# EAGLE schematic AutoCar (EAGLE 9.5.0)
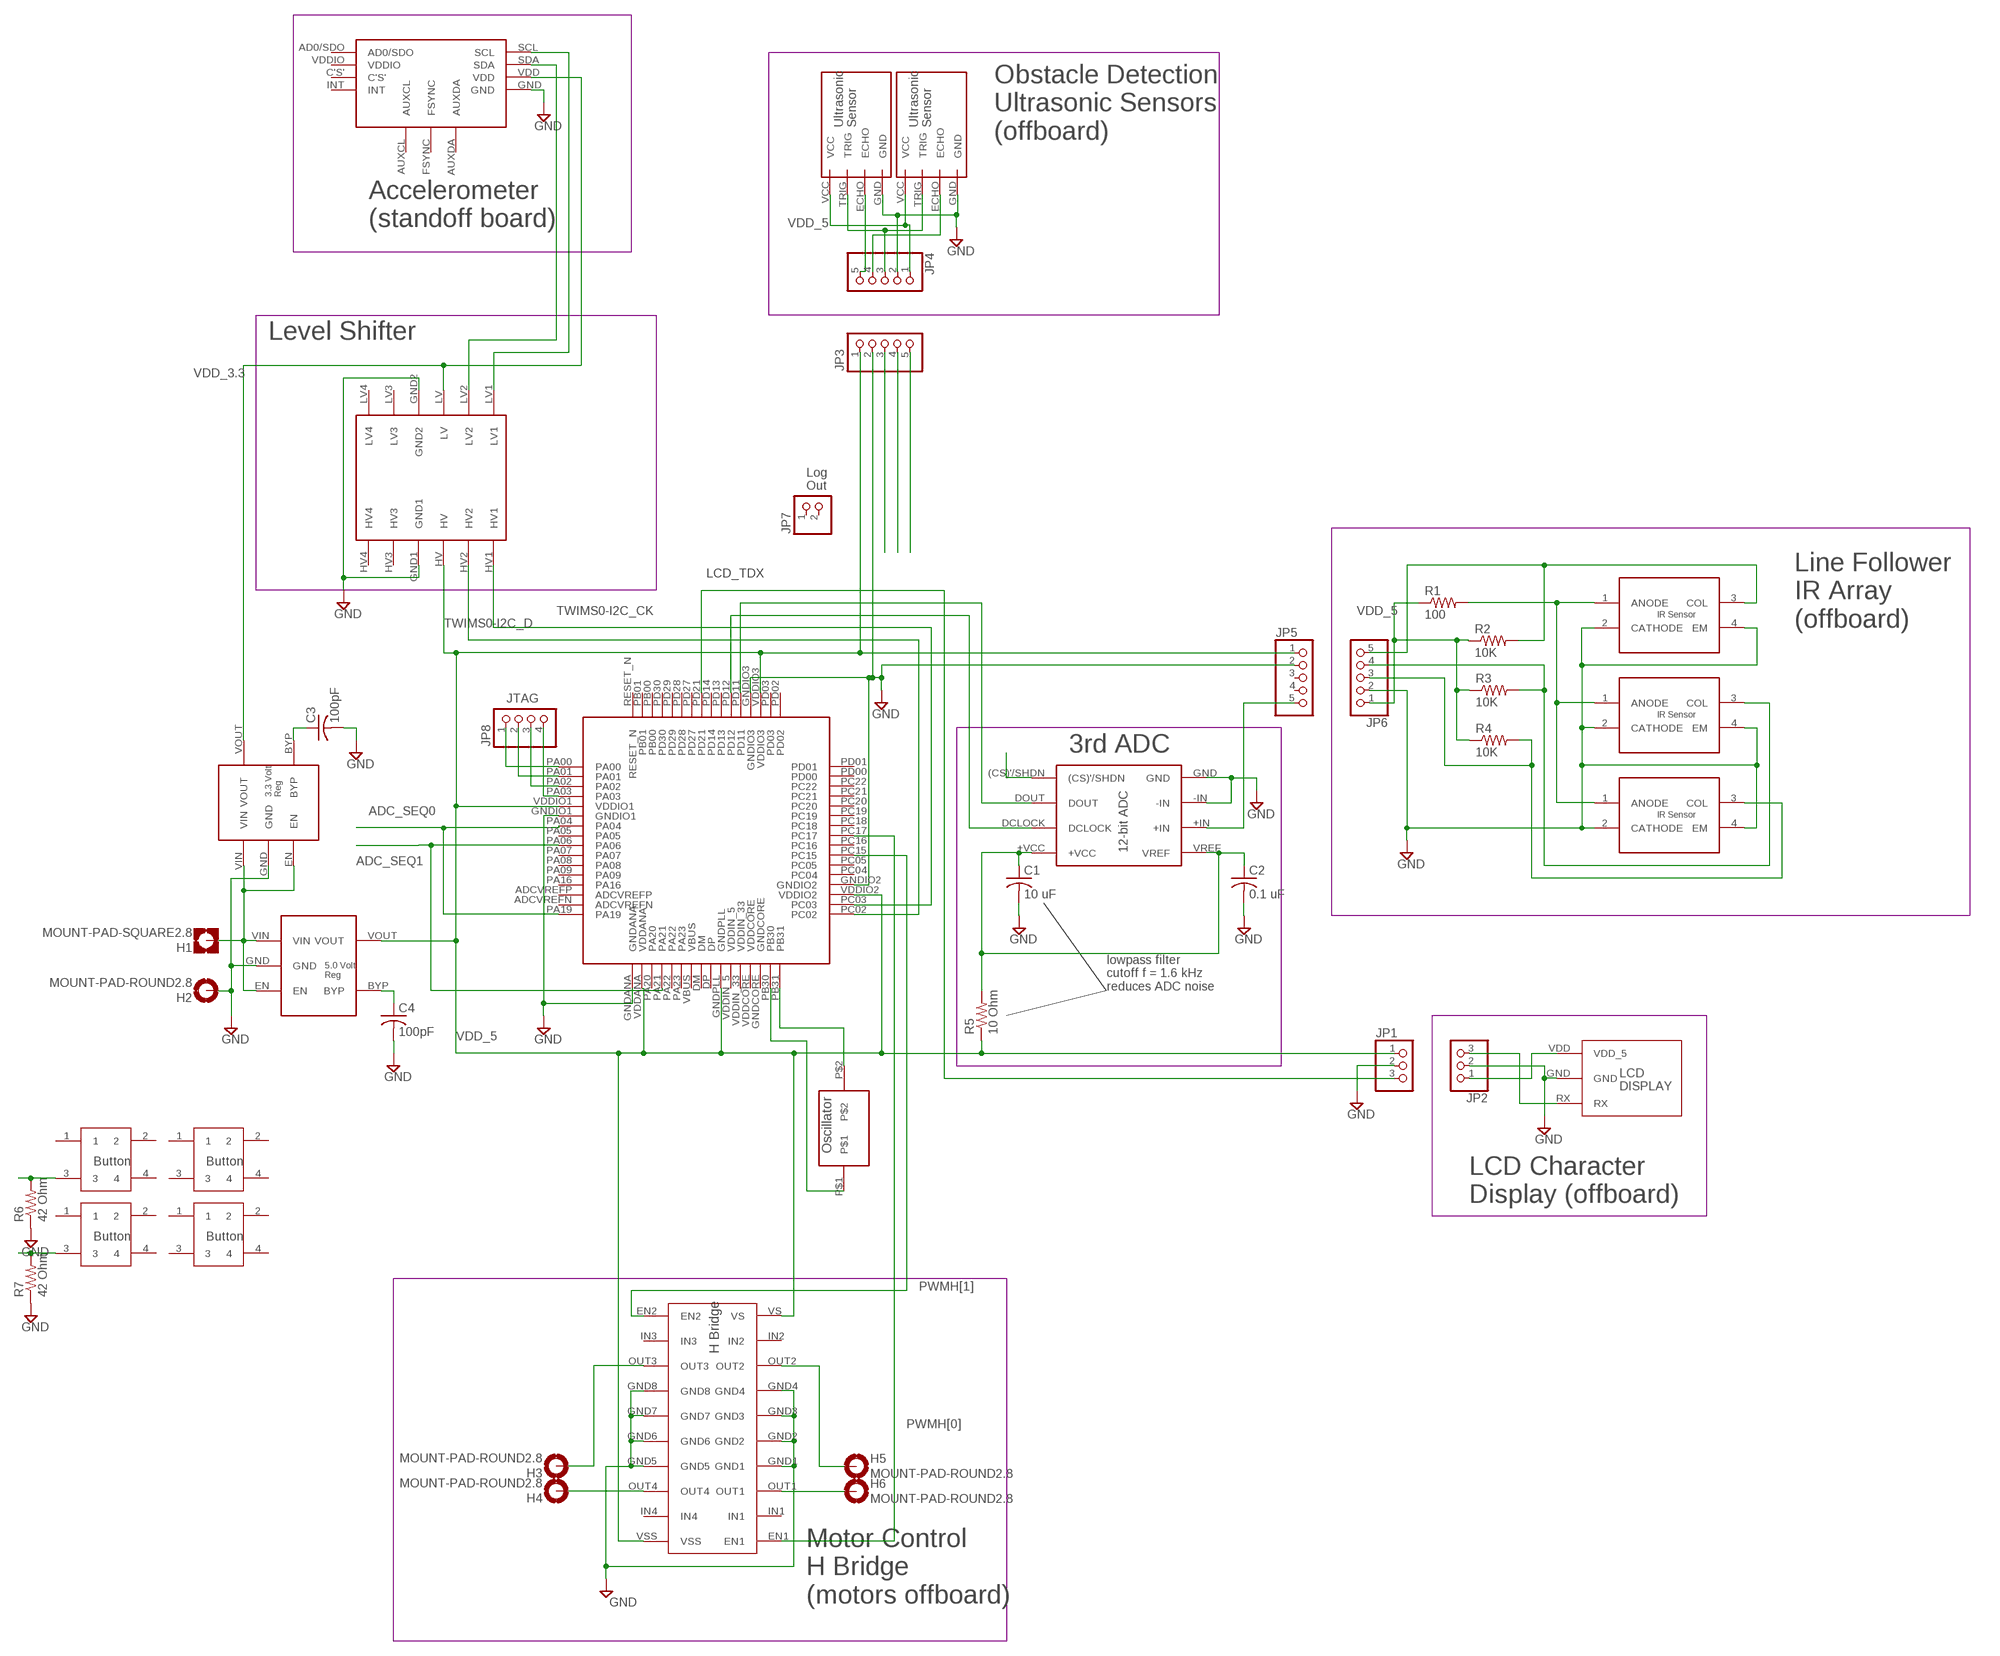
[diagram p0: schematic, sheet 1]

## Parts
C1  10 uF  C-USC0805  [C0805]
C2  0.1 uF  C-USC0805  [C0805]
C3  100pF  C-USC0805  [C0805]
C4  100pF  C-USC0805  [C0805]
H1  MOUNT-PAD-SQUARE2.8  [2,8-PAD-SQUARE]
H2  MOUNT-PAD-ROUND2.8  [2,8-PAD]
H3  MOUNT-PAD-ROUND2.8  [2,8-PAD]
H4  MOUNT-PAD-ROUND2.8  [2,8-PAD]
H5  MOUNT-PAD-ROUND2.8  [2,8-PAD]
H6  MOUNT-PAD-ROUND2.8  [2,8-PAD]
JP1  PINHD-1X3  [1X03]
JP2  PINHD-1X3  [1X03]
JP3  PINHD-1X5  [1X05]
JP4  PINHD-1X5  [1X05]
JP5  PINHD-1X5  [1X05]
JP6  PINHD-1X5  [1X05]
JP7  PINHD-1X2  [1X02]
JP8  PINHD-1X4  [1X04]
R1  100  R-US_M0805  [M0805]
R2  10K  R-US_M0805  [M0805]
R3  10K  R-US_M0805  [M0805]
R4  10K  R-US_M0805  [M0805]
R5  10 Ohm  R-US_M0805  [M0805]
R6  42 Ohm  R-US_M0805  [M0805]
R7  42 Ohm  R-US_M0805  [M0805]
U$1  AT32UC3C2512C-A2UT  [TQFP-64]
U$2  QRE1113GR  [4-SMD]
U$3  QRE1113GR  [4-SMD]
U$4  QRE1113GR  [4-SMD]
U$5  SEN-15569  [HC-SR04]
U$6  SEN-15569  [HC-SR04]
U$7  AP2210K-5.0TRG1  [SC-74A]
U$8  SEN-13762  [MPU-9250]
U$9  BOB-12009  [BSS138]
U$10  AP2210K-3.3TRG1  [SC-74A]
U$11  ADAFRUIT-782  [LCD-3]
U$12  L293DD  [SOIC20]
U$13  ADS7816U  [8-SOIC]
U$14  LFXTAL003210BULK  [HC-49/US]
U$15  PTS645SM43SMTR92LFS  [SM43SMTR92LFS]
U$16  PTS645SM43SMTR92LFS  [SM43SMTR92LFS]
U$17  PTS645SM43SMTR92LFS  [SM43SMTR92LFS]
U$18  PTS645SM43SMTR92LFS  [SM43SMTR92LFS]

## Nets
ADC_SEQ0: U$1.PA04 U$1.PA19
ADC_SEQ1: U$1.PA06
ECHO_L: JP3.4 JP4.5 U$6.ECHO
ECHO_R: JP3.5 JP4.4 U$5.ECHO
GND: C1.2 C2.2 C3.2 C4.2 H2.B2,8(MOUNT) JP1.2 JP2.2 JP3.2 JP5.2 JP6.2 R6.1 R7.1 U$1.GNDANA U$1.GNDIO1 U$1.GNDIO2 U$1.GNDIO3 U$2.2(CATHODE) U$2.4(EM) U$3.2(CATHODE) U$3.4(EM) U$4.2(CATHODE) U$4.4(EM) U$5.GND U$6.GND U$7.GND U$8.GND U$9.GND1 U$9.GND2 U$10.GND U$11.GND U$12.GND1 U$12.GND2 U$12.GND3 U$12.GND4 U$12.GND5 U$12.GND6 U$12.GND7 U$12.GND8 U$13.-IN U$13.GND
LCD_TDX: JP1.3 U$1.PD21
N$1: JP2.1 U$11.VDD(VDD_5)
N$2: H3.B2,8(MOUNT) U$12.OUT3
N$3: H1.B2,8(MOUNT) U$7.EN U$7.VIN U$10.EN U$10.VIN
N$4: H4.B2,8(MOUNT) U$12.OUT4
N$5: H5.B2,8(MOUNT) U$12.OUT2
N$6: H6.B2,8(MOUNT) U$12.OUT1
N$7: JP4.2
N$8: U$1.PB30 U$14.P$1
N$9: JP4.3 U$5.TRIG U$6.TRIG
N$10: U$8.SDA U$9.LV2
N$11: U$8.SCL U$9.LV1
N$12: R1.2 U$2.1(ANODE) U$3.1(ANODE) U$4.1(ANODE)
N$13: JP6.5 R2.2 U$2.3(COL)
N$14: U$1.PB31 U$14.P$2
N$15: JP6.4 R3.2 U$3.3(COL)
N$16: JP6.3 R4.2 U$4.3(COL)
N$17: JP3.3
N$18: C1.1 C2.1 R5.2 U$13.+VCC U$13.VREF
N$19: JP8.1 U$1.PA00
N$20: JP2.3 U$11.RX
N$21: JP5.5 U$13.+IN
N$22: U$1.PA21
N$23: U$1.PD12 U$13.DCLOCK
N$24: U$1.PD11 U$13.DOUT
N$25: JP8.2 U$1.PA01
N$26: JP8.3 U$1.PA02
N$27: JP8.4 U$1.PA03
N$29: C3.1 U$10.BYP
N$30: C4.1 U$7.BYP
N$31: R6.2 U$18.3
N$32: R7.2 U$17.3
N$33: U$13.(CS)'/SHDN
PWMH[0]: U$1.PC17 U$12.EN1
PWMH[1]: U$1.PC15 U$12.EN2
TWIMS0-I2C_CK: U$1.PC03 U$9.HV1
TWIMS0-I2C_D: U$1.PC02 U$9.HV2
VDD_3.3: U$8.VDD U$9.LV U$10.VOUT
VDD_5: JP1.1 JP3.1 JP4.1 JP5.1 JP6.1 R1.1 R2.1 R3.1 R4.1 R5.1 U$1.GNDPLL U$1.VDDANA U$1.VDDIO1 U$1.VDDIO2 U$1.VDDIO3 U$5.VCC U$6.VCC U$7.VOUT U$9.HV U$12.VS U$12.VSS
Unconnected: JP5.3 JP5.4 JP7.1 JP7.2 U$1.ADCVREFN U$1.ADCVREFP U$1.DM U$1.DP U$1.GNDCORE U$1.PA05 U$1.PA07 U$1.PA08 U$1.PA09 U$1.PA16 U$1.PA20 U$1.PA22 U$1.PA23 U$1.PB00 U$1.PB01 U$1.PC04 U$1.PC05 U$1.PC16 U$1.PC18 U$1.PC19 U$1.PC20 U$1.PC21 U$1.PC22 U$1.PD00 U$1.PD01 U$1.PD02 U$1.PD03 U$1.PD13 U$1.PD14 U$1.PD27 U$1.PD28 U$1.PD29 U$1.PD30 U$1.RESET_N U$1.VBUS U$1.VDDCORE U$1.VDDIN_5 U$1.VDDIN_33 U$8.AD0/SDO U$8.AUXCL U$8.AUXDA U$8.C'S' U$8.FSYNC U$8.INT U$8.VDDIO U$9.HV3 U$9.HV4 U$9.LV3 U$9.LV4 U$12.IN1 U$12.IN2 U$12.IN3 U$12.IN4 U$15.1 U$15.2 U$15.3 U$15.4 U$16.1 U$16.2 U$16.3 U$16.4 U$17.1 U$17.2 U$17.4 U$18.1 U$18.2 U$18.4

## Notes on the sheet
- Obstacle Detection
  Ultrasonic Sensors
  (offboard)
- Accelerometer
  (standoff board)
- Level Shifter
- Log
  Out
- Line Follower
  IR Array
  (offboard)
- JTAG
- 3rd ADC
- lowpass filter
  cutoff f = 1.6 kHz
  reduces ADC noise
- LCD Character
  Display (offboard)
- Motor Control
  H Bridge
  (motors offboard)

## Library data of the parts
C1-C4 = rcl:C-US: CAPACITOR, American symbol; SPICEPREFIX: C
H1 = holes:MOUNT-PAD-SQUARE: MOUNTING PAD, square
H2-H6 = holes:MOUNT-PAD-ROUND: MOUNTING PAD, round
JP1 JP2 = pinhead:PINHD-1X3: PIN HEADER
JP3-JP6 = pinhead:PINHD-1X5: PIN HEADER
JP7 = pinhead:PINHD-1X2: PIN HEADER
JP8 = pinhead:PINHD-1X4: PIN HEADER
R1-R7 = rcl:R-US_: RESISTOR, American symbol; SPICEPREFIX: R
U$1 = MILESTONE4LIB_E:AT32UC3C2512C-A2UT
U$2-U$4 = MILESTONE4LIB_E:QRE1113GR
U$5 U$6 = MILESTONE4LIB_E:SEN-15569
U$7 = MILESTONE4LIB_E:AP2210K-5.0TRG1
U$8 = miu:SEN-13762
U$9 = levelshifter:BOB-12009
U$10 = MILESTONE4LIB_E:AP2210K-3.3TRG1
U$11 = MILESTONE4LIB_E:ADAFRUIT-782
U$12 = MILESTONE4LIB_E:L293DD
U$13 = MILESTONE4LIB_E:ADS7816U
U$14 = MILESTONE4LIB_E:LFXTAL003210BULK
U$15-U$18 = MILESTONE4LIB_E:PTS645SM43SMTR92LFS